# Altium schematic sheet encoder-filter-diagram.SchDoc
size A4; SheetNumber: 9; SheetTotal: 9
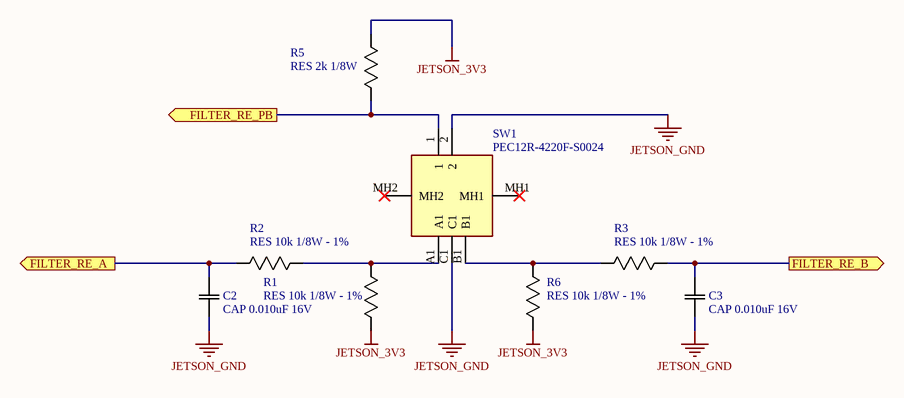
[diagram p0: encoder-filter-diagram.SchDoc]

## Parts
C2  CAP 0.010uF 16V  [0603]
C3  CAP 0.010uF 16V  [0603]
R1  RES 10k 1/8W - 1%  [0603]
R2  RES 10k 1/8W - 1%  [0603]
R3  RES 10k 1/8W - 1%  [0603]
R5  RES 2k 1/8W  [0603]
R6  RES 10k 1/8W - 1%  [0603]
SW1  PEC12R-4220F-S0024  [PEC12R4220FS0024]

## Ports
FILTER_RE_A (out), FILTER_RE_B (out), FILTER_RE_PB (out)

## Nets
JETSON_3V3: R1.2(R2) R5.1(R1) R6.2(R2)
JETSON_GND: C2.1(C1) C3.1(C1) SW1.2 SW1.C1
FILTER_RE_A: C2.2(C2) R2.2(R2) ; port FILTER_RE_A
FILTER_RE_B: C3.2(C2) R3.1(R1) ; port FILTER_RE_B
FILTER_RE_PB: R5.2(R2) SW1.1 ; port FILTER_RE_PB
NetR1_1: R1.1(R1) R2.1(R1) SW1.A1
NetR3_2: R3.2(R2) R6.1(R1) SW1.B1

Not connected (* = marked no-connect by the designer): SW1 MH1* MH2*

## Library data of the parts
C2 C3 = CAP 0.010uF 16V: Default Symbol for Capacitors; Temperature Coefficient: X5R; Tolerance: 10%; Value: 0.010uF; Rating: 16V; Operating Temperature: -55°C ~ 125°C; Part Number: CAP 0.010uF 16V
R1-R3 R6 = RES 10k 1/8W - 1%: Default Resistor Symbol; Value: 1; Power (Watts): 0.125W; Tolerance: 5%; Package: 0805; Part Number: RES 10k 1/8W - 1%
R5 = RES 2k 1/8W: Default Resistor Symbol; Value: 1; Power (Watts): 0.125W; Tolerance: 5%; Package: 0805; Part Number: RES 2k 1/8W
SW1 = PEC12R4220FS0024: Rotary Encoder; Manufacturer_Name: Bourns; Datasheet Link: https://componentsearchengine.com/Datasheets/5/PEC12R-4220F-S0024.pdf; Height: 20mm; Manufacturer_Part_Number: PEC12R-4220F-S0024; Mouser Part Number: 652-PEC12R-4220F-S24; Mouser Price/Stock: https://www.mouser.co.uk/ProductDetail/Bourns/PEC12R-4220F-S0024?qs=Zq5ylnUbLm7u%2FuPQvUoR4Q%3D%3D; Arrow Part Number: PEC12R-4220F-S0024; Arrow Price/Stock: https://www.arrow.com/en/products/pec12r-4220f-s0024/bourns; Part Number: PEC12R4220FS0024; Supplier 1: Digi-key; Supplier Part Number 1: PEC12R-4220F-S0024-ND; Supplier URL 1: https://www.digikey.ca/en/products/detail/bourns-inc/PEC12R-4220F-S0024/4499653